# EAGLE schematic v001 (EAGLE 6.4)
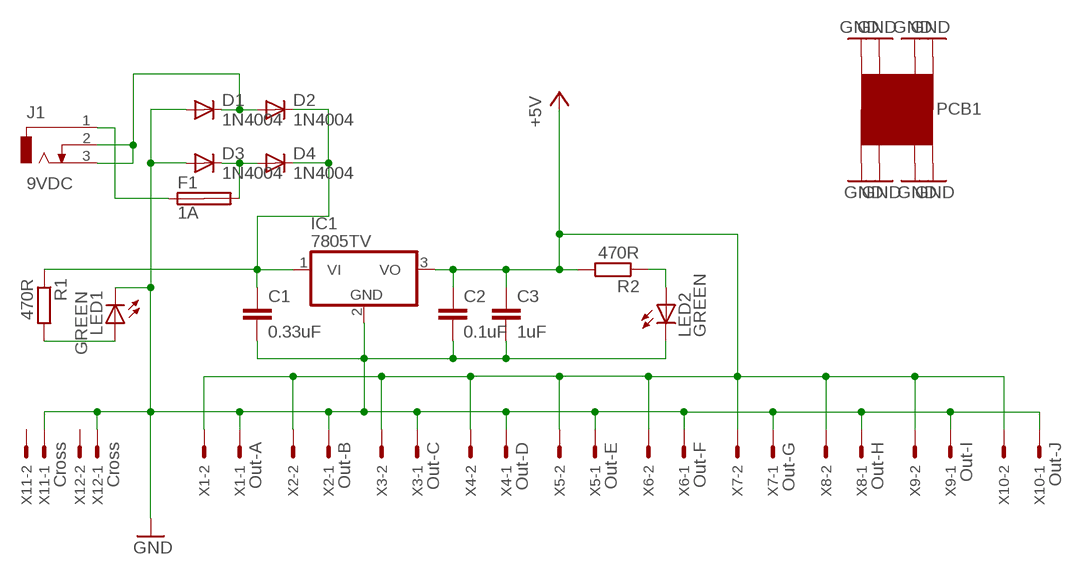
[diagram p0: schematic, sheet 1]

## Parts
C1  0.33uF  C-EU050-030X075  [C050-030X075]
C2  0.1uF  C-EU050-024X044  [C050-024X044]
C3  1uF  C-EU050-045X075  [C050-045X075]
D1  1N4004  1N4148DO35-7  [DO35-7]
D2  1N4004  1N4148DO35-7  [DO35-7]
D3  1N4004  1N4148DO35-7  [DO35-7]
D4  1N4004  1N4148DO35-7  [DO35-7]
F1  1A  SHK20L  [SHK20L]
IC1  7805TV  [TO220V]
J1  9VDC  DCJ0202  [DCJ0202]
LED1  GREEN  LED3MM  [LED3MM]
LED2  GREEN  LED3MM  [LED3MM]
PCB1  PCB05X05  [PCB_05X05]
R1  470R  R-EU_0204/7  [0204/7]
R2  470R  R-EU_0204/7  [0204/7]
X1  Out-A  22-27-2021-02  [6410-02]
X2  Out-B  22-27-2021-02  [6410-02]
X3  Out-C  22-27-2021-02  [6410-02]
X4  Out-D  22-27-2021-02  [6410-02]
X5  Out-E  22-27-2021-02  [6410-02]
X6  Out-F  22-27-2021-02  [6410-02]
X7  Out-G  22-27-2021-02  [6410-02]
X8  Out-H  22-27-2021-02  [6410-02]
X9  Out-I  22-27-2021-02  [6410-02]
X10  Out-J  22-27-2021-02  [6410-02]
X11  Cross  22-27-2021-02  [6410-02]
X12  Cross  22-27-2021-02  [6410-02]

## Nets
+5V: C2.1 C3.1 IC1.3(VO) R2.2 X1.2 X2.2 X3.2 X4.2 X5.2 X6.2 X7.2 X8.2 X9.2 X10.2
GND: C1.2 C2.2 C3.2 D1.A D3.A IC1.2(GND) LED1.K(C) LED2.K(C) PCB1.GND@1(GND) PCB1.GND@2(GND) PCB1.GND@3(GND) PCB1.GND@4(GND) PCB1.GND@5(GND) PCB1.GND@6(GND) PCB1.GND@7(GND) PCB1.GND@8(GND) X1.1 X2.1 X3.1 X4.1 X5.1 X6.1 X7.1 X8.1 X9.1 X10.1 X11.1 X12.1
N$1: C1.1 D2.C D4.C IC1.1(VI) R1.1
N$3: LED1.A R1.2
N$4: F1.1A J1.1
N$5: LED2.A R2.1
N$7: D1.C D2.A J1.2 J1.3
N$8: D3.C D4.A F1.2A
Unconnected: F1.1B F1.2B X11.2 X12.2

## Library data of the parts
C1-C3 = rcl:C-EU: CAPACITOR, European symbol
D1-D4 = diode:1N4148: DIODE high speed (Philips)
F1 = fuse:SHK20L: FUSE HOLDER 5 x 20 mm, SH contact, SHH1 Schukat, E1073 Buerklin; OC_FARNELL: unknown; OC_NEWARK: unknown
IC1 = linear:78*: Positive VOLTAGE REGULATOR Source: http://cache.national.com/ds/LM/LM78L05.pdf http://www.fairchildsemi.com/ds/LM/LM7805.pdf
J1 = con-jack:DCJ0202: DC POWER JACK Source: DCJ0202.pdf; OC_FARNELL: unknown; OC_NEWARK: unknown
LED1 LED2 = led:LED: LED OSRAM: - CHIPLED LG R971, LG N971, LY N971, LG Q971, LY Q971, LO R971, LY R971 LH N974, LH R974 LS Q976, LO Q976, LY Q976 LO Q996 - Hyper CHIPLED LW Q18S LB Q993, LB Q99A, LB R99A - SideLED LS A670, LO A670, LY A670, LG A670, LP A670 LB A673, LV A673, LT A673, LW A673 LH A674 LY A675 LS A676, LA A676, LO A676, LY A676, LW A676 LS A679, LY A679, LG A679 - Hyper Micro SIDELED® LS Y876, LA Y876, LO Y876, LY Y876 LT Y87S - SmartLED LW L88C, LW L88S LB L89C, LB L89S, LG L890 LS L89K, LO L89K, LY L89K LS L896, LA L896, LO L896, LY L896 - TOPLED LS T670, LO T670, LY T670, LG T670, LP T670 LSG T670, LSP T670, LSY T670, LOP T670, LYG T670 LG T671, LOG T671, LSG T671 LB T673, LV T673, LT T673, LW T673 LH T674 LS T676, LA T676, LO T676, LY T676, LB T676, LH T676, LSB T676, LW T676 LB T67C, LV T67C, LT T67C, LS T67K, LO T67K, LY T67K, LW E67C LS E67B, LA E67B, LO E67B, LY E67B, LB E67C, LV E67C, LT E67C LW T67C LS T679, LY T679, LG T679 LS T770, LO T770, LY T770, LG T770, LP T770 LB T773, LV T773, LT T773, LW T773 LH T774 LS E675, LA E675, LY E675, LS T675 LS T776, LA T776, LO T776, LY T776, LB T776 LHGB T686 LT T68C, LB T68C - Hyper Mini TOPLED® LB M676 - Mini TOPLED Santana® LG M470 LS M47K, LO M47K, LY M47K Source: http://www.osram.convergy.de LUXEON: - LUMILED® LXK2-PW12-R00, LXK2-PW12-S00, LXK2-PW14-U00, LXK2-PW14-V00 LXK2-PM12-R00, LXK2-PM12-S00, LXK2-PM14-U00 LXK2-PE12-Q00, LXK2-PE12-R00, LXK2-PE12-S00, LXK2-PE14-T00, LXK2-PE14-U00 LXK2-PB12-K00, LXK2-PB12-L00, LXK2-PB12-M00, LXK2-PB14-N00, LXK2-PB14-P00, LXK2-PB14-Q00 LXK2-PR12-L00, LXK2-PR12-M00, LXK2-PR14-Q00, LXK2-PR14-R00 LXK2-PD12-Q00, LXK2-PD12-R00, LXK2-PD12-S00 LXK2-PH12-R00, LXK2-PH12-S00 LXK2-PL12-P00, LXK2-PL12-Q00, LXK2-PL12-R00 Source: www.luxeon.com KINGBRIGHT: KA-3528ASYC Source: www.kingbright.com
PCB1 = GNLib:PCB
R1 R2 = rcl:R-EU_: RESISTOR, European symbol
X1-X12 = con-molex:22-?-02: CONNECTOR wire to board 2.54 mm (.1 inch) pitch header; OC_FARNELL: unknown; OC_NEWARK: unknown